# Altium schematic sheet STM.SchDoc
size 406 x 254 mm; SheetNumber: 1; SheetTotal: 2
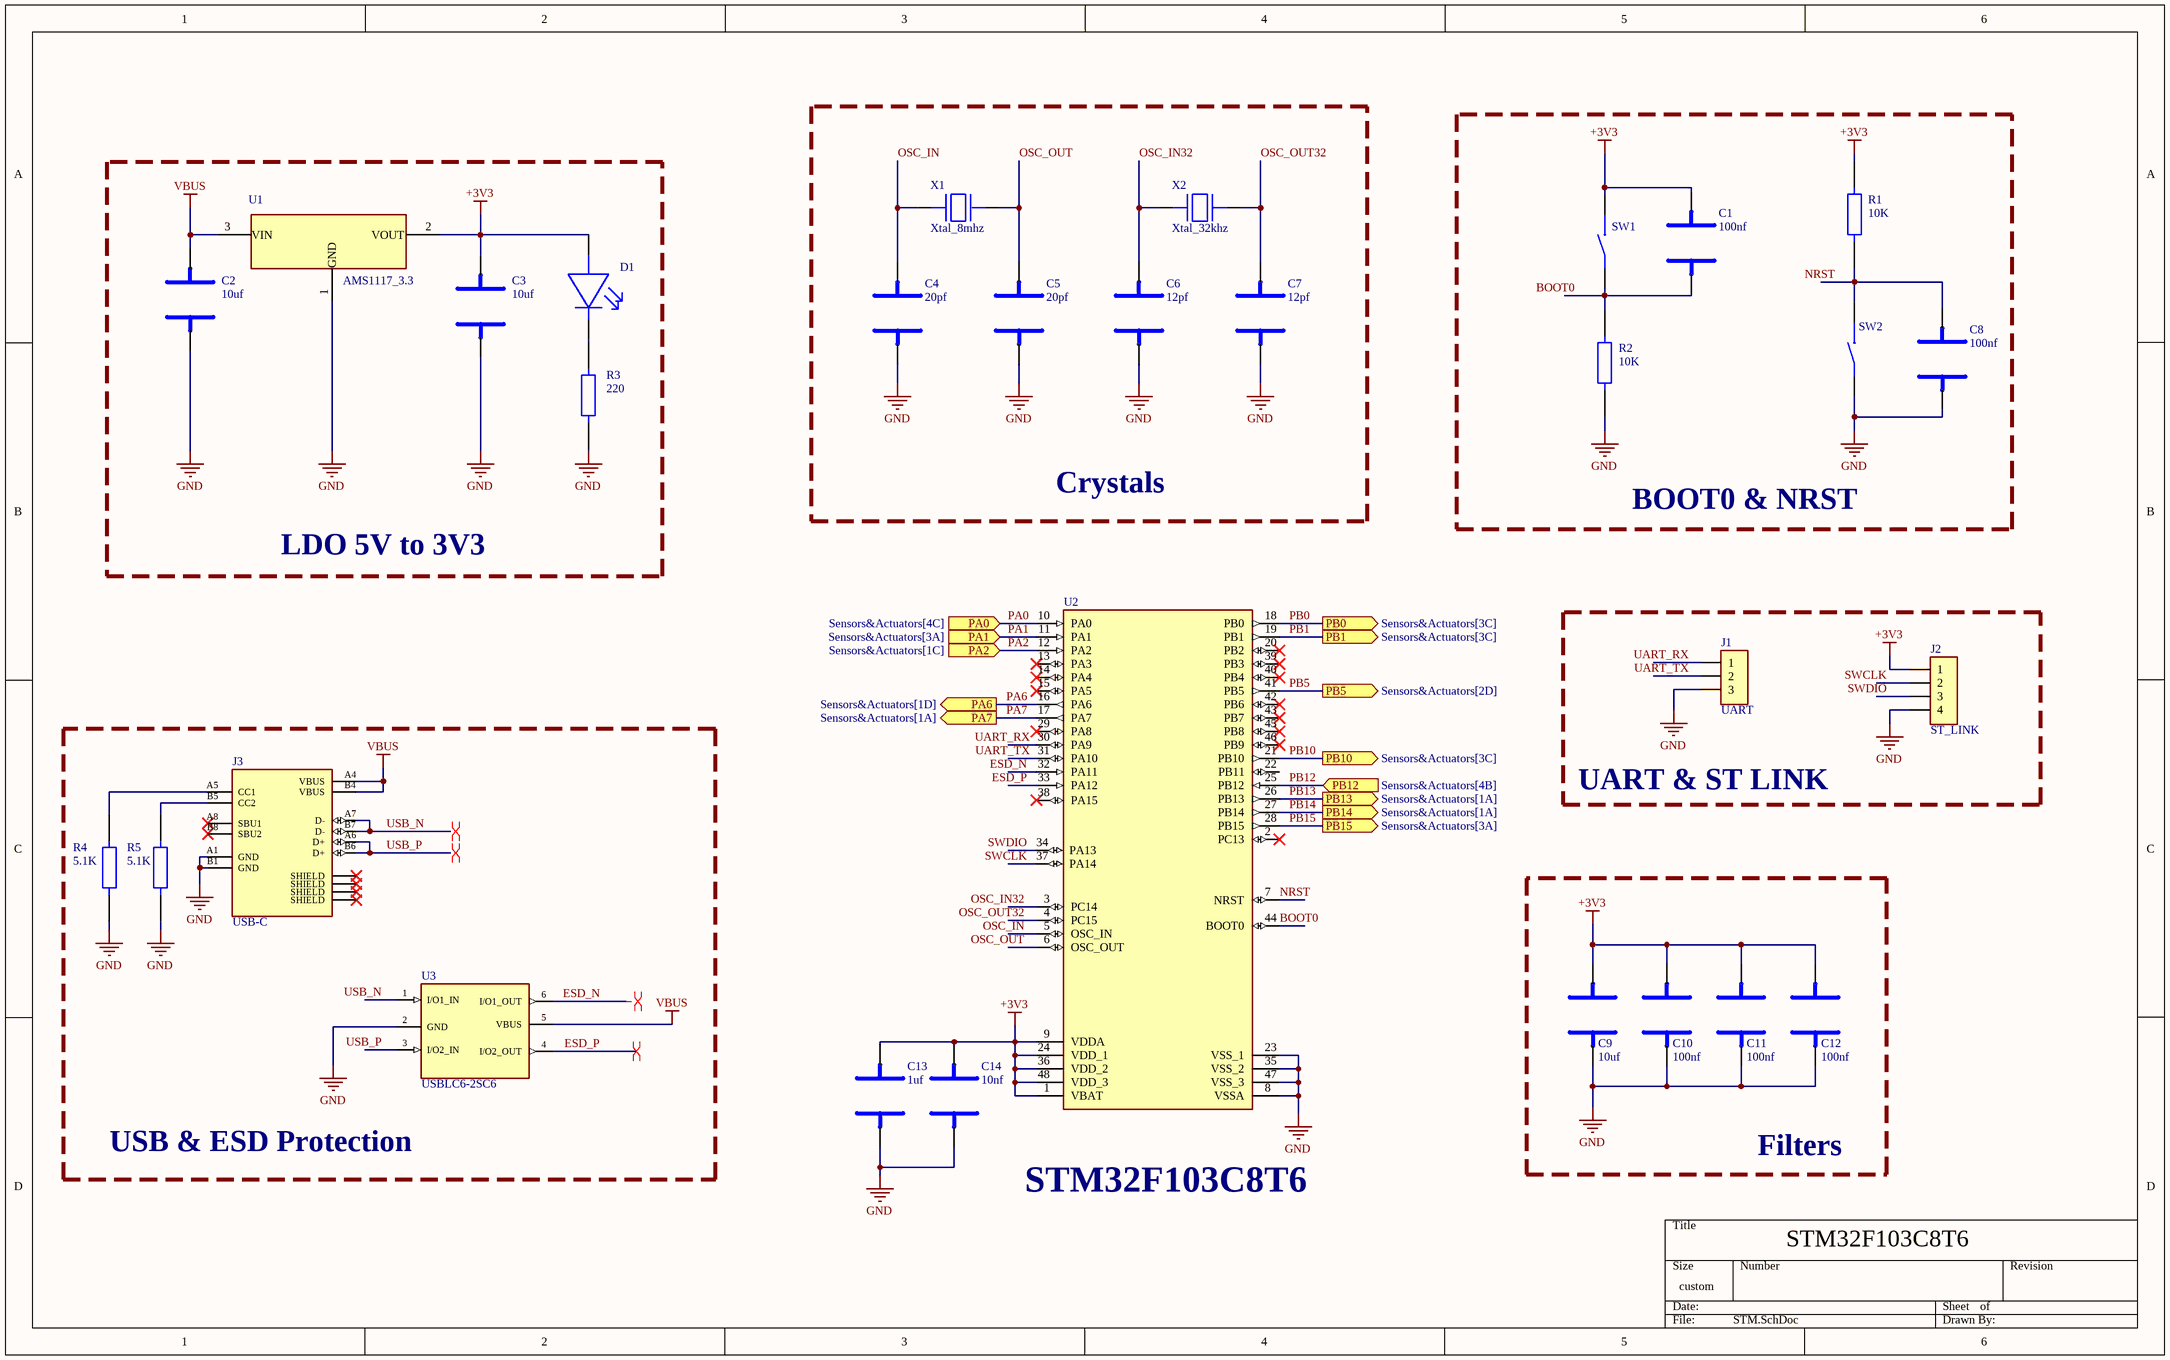
[diagram p0: STM.SchDoc]

## Parts
C1  100nf  [Cap_0805]
C2  10uf  [Cap_0805]
C3  10uf  [Cap_0805]
C4  20pf  [Cap_0805]
C5  20pf  [Cap_0805]
C6  12pf  [Cap_0805]
C7  12pf  [Cap_0805]
C8  100nf  [Cap_0805]
C9  10uf  [Cap_0805]
C10  100nf  [Cap_0805]
C11  100nf  [Cap_0805]
C12  100nf  [Cap_0805]
C13  1uf  [Cap_0805]
C14  10nf  [Cap_0805]
D1  LED_0805  [LED_0805]  (value not drawn)
J1  UART  [pin_header_3]
J2  ST_LINK  [pin_header_4]
J3  USB-C  [USB_C]
R1  10K  [RES_0805]
R2  10K  [RES_0805]
R3  220  [RES_0805]
R4  5.1K  [RES_0805]
R5  5.1K  [RES_0805]
SW1  Switch  [switch]  (value not drawn)
SW2  Switch  [switch]  (value not drawn)
U1  AMS1117_3.3  [AMS1117]
U2  STM32F103C8T6  [STM32F103C8T6]
U3  USBLC6-2SC6  [USBLC6-2SC6]
X1  Xtal_8mhz  [Xtal_8mhz]
X2  Xtal_32khz  [Xtal_32khz]

## Blocks framed on the sheet
Crystals: C4-C7 X1 X2
BOOT0 & NRST: C1 C8 R1 R2 SW1 SW2
LDO 5V to 3V3: C2 C3 D1 R3 U1
UART & ST LINK: J1 J2
USB & ESD Protection: J3 R4 R5 U3
Filters: C9-C12

## Ports
PA0 (in, see Sensors&Actuators[4C]), PA1 (in, see Sensors&Actuators[3A]), PA2 (in, see Sensors&Actuators[1C]), PA6 (out, see Sensors&Actuators[1D]), PA7 (out, see Sensors&Actuators[1A]), PB0 (out, see Sensors&Actuators[3C]), PB1 (out, see Sensors&Actuators[3C]), PB5 (out, see Sensors&Actuators[2D]), PB10 (out, see Sensors&Actuators[3C]), PB12 (in, see Sensors&Actuators[4B]), PB13 (out, see Sensors&Actuators[1A]), PB14 (out, see Sensors&Actuators[1A]), PB15 (out, see Sensors&Actuators[3A])

## Nets
+3V3: C1.2 C3.2 C9.2 C10.2 C11.2 C12.2 C13.2 C14.2 D1.1 J2.1 R1.1 SW1.2 U1.2(VOUT) U2.1(VBAT) U2.9(VDDA) U2.24(VDD_1) U2.36(VDD_2) U2.48(VDD_3)
GND: C2.1 C3.1 C4.1 C5.1 C6.1 C7.1 C8.1 C9.1 C10.1 C11.1 C12.1 C13.1 C14.1 J1.3 J2.4 J3.A1(GND) J3.B1(GND) R2.1 R3.2 R4.2 R5.2 SW2.1 U1.1(GND) U2.8(VSSA) U2.23(VSS_1) U2.35(VSS_2) U2.47(VSS_3) U3.2(GND)
VBUS: C2.2 J3.A4(VBUS) J3.B4(VBUS) U1.3(VIN) U3.5(VBUS)
BOOT0: C1.1 R2.2 SW1.1 U2.44(BOOT0)
ESD_N: U2.32(PA11) U3.6(I/O1_OUT)
ESD_P: U2.33(PA12) U3.4(I/O2_OUT)
NRST: C8.2 R1.2 SW2.2 U2.7(NRST)
OSC_IN: C4.2 U2.5(OSC_IN) X1.1
OSC_IN32: C6.2 U2.3(PC14) X2.1
OSC_OUT: C5.2 U2.6(OSC_OUT) X1.2
OSC_OUT32: C7.2 U2.4(PC15) X2.2
PA0: U2.10(PA0) ; port PA0
PA1: U2.11(PA1) ; port PA1
PA2: U2.12(PA2) ; port PA2
PA6: U2.16(PA6) ; port PA6
PA7: U2.17(PA7) ; port PA7
PB0: U2.18(PB0) ; port PB0
PB1: U2.19(PB1) ; port PB1
PB5: U2.41(PB5) ; port PB5
PB10: U2.21(PB10) ; port PB10
PB12: U2.25(PB12) ; port PB12
PB13: U2.26(PB13) ; port PB13
PB14: U2.27(PB14) ; port PB14
PB15: U2.28(PB15) ; port PB15
SWCLK: J2.2 U2.37(PA14)
SWDIO: J2.3 U2.34(PA13)
UART_RX: J1.1 U2.30(PA9)
UART_TX: J1.2 U2.31(PA10)
USB_N: J3.A7(D-) J3.B7(D-) U3.1(I/O1_IN)
USB_P: J3.A6(D+) J3.B6(D+) U3.3(I/O2_IN)
NetD1_2: D1.2 R3.1
NetJ3_A5: J3.A5(CC1) R4.1
NetJ3_B5: J3.B5(CC2) R5.1

Not connected (* = marked no-connect by the designer): J3 A8(SBU1)* B8(SBU2)* S1(SHIELD)* S2(SHIELD)* S3(SHIELD)* S4(SHIELD)*; U2 2(PC13)* 13(PA3)* 14(PA4)* 15(PA5)* 20(PB2)* 22(PB11) 29(PA8)* 38(PA15)* 39(PB3)* 40(PB4)* 42(PB6)* 43(PB7)* 45(PB8)* 46(PB9)*

## Layout directives
differential pair; differential pair class USB_Diff: USB_N, USB_P
differential pair; differential pair class ESD_DIFF: ESD_N, ESD_P

## Notes on the sheet
- STM32F103C8T6

## Library data of the parts
C1 C8 C10-C12 = Cap_0805_100nf: CAP CER 100nF 50V X7R 0805; MFR: Samsung Electro-Mechanics; MFR PART#: CL21B104KBCNNNC; Supplier: LCSC; Supplier PART#: C1711; ComponentLink1Description: Data Sheet; ComponentLink1URL: https://www.lcsc.com/datasheet/C15850.pdf?spm=wm.sxq.inf.ggs___wm.fly.bg.0.xh&lcsc_vid=RAIMXwZeRgRXUFAAT1RZBAEFEVIIVgdSQFlfUgUDFQcxVlNeQVVYX1FWR1FeVDsOAxUeFF5JWBYZEEoKFBINSQcJGk4eFQsCAgIaSgADAwAHC0slT1VdUFJIHxUDCw%3D%3D
C2 C3 C9 = Cap_0805_10uf: CAP CER 10uF 25V X5R 0805; MFR: Samsung Electro-Mechanics; MFR PART#: CL21A106KAYNNNE; Supplier: LCSC; Supplier PART#: C15850; ComponentLink1Description: Data Sheet; ComponentLink1URL: https://www.lcsc.com/datasheet/C15850.pdf?spm=wm.sxq.inf.ggs___wm.fly.bg.0.xh&lcsc_vid=RAIMXwZeRgRXUFAAT1RZBAEFEVIIVgdSQFlfUgUDFQcxVlNeQVVYX1FWR1FeVDsOAxUeFF5JWBYZEEoKFBINSQcJGk4eFQsCAgIaSgADAwAHC0slT1VdUFJIHxUDCw%3D%3D
C4 C5 = Cap_0805_20pf: CAP CER 20pF 50V C0G 0805; MFR: Samsung Electro-Mechanics; MFR PART#: CL21C200JBANNNC; Supplier: LCSC; Supplier PART#: C1798; ComponentLink1Description: Data Sheet; ComponentLink1URL: https://www.lcsc.com/datasheet/C1798.pdf?spm=wm.sxq.inf.ggs___wm.ssy.bg.11.xh&lcsc_vid=RAIMXwZeRgRXUFAAT1RZBAEFEVIIVgdSQFlfUgUDFQcxVlNeQFJfX1ZeR1FXVjsOAxUeFF5JWBYZEEoKFBINSQcJGk4dAgUUFAk%3D
C6 C7 = Cap_0805_12pf: CAP CER 12pF 50V C0G 0805; MFR: Samsung Electro-Mechanics; MFR PART#: CL21C120JBANNNC; Supplier: LCSC; Supplier PART#: C170110; ComponentLink1Description: Data Sheet; ComponentLink1URL: https://www.lcsc.com/datasheet/C170110.pdf?spm=wm.sxq.inf.ggs___wm.fly.bg.0.xh&lcsc_vid=RAIMXwZeRgRXUFAAT1RZBAEFEVIIVgdSQFlfUgUDFQcxVlNeQFJfX1BXQVdcVzsOAxUeFF5JWBYZEEoKFBINSQcJGk4dAgUUFAk%3D
C13 = Cap_0805_1uf: CAP CER 1uF 50V X7R 0805; MFR: Samsung Electro-Mechanics; MFR PART#: CL21B105KBFNNNE; Supplier: LCSC; Supplier PART#: C28323; ComponentLink1Description: Data Sheet; ComponentLink1URL: https://www.lcsc.com/datasheet/C15850.pdf?spm=wm.sxq.inf.ggs___wm.fly.bg.0.xh&lcsc_vid=RAIMXwZeRgRXUFAAT1RZBAEFEVIIVgdSQFlfUgUDFQcxVlNeQVVYX1FWR1FeVDsOAxUeFF5JWBYZEEoKFBINSQcJGk4eFQsCAgIaSgADAwAHC0slT1VdUFJIHxUDCw%3D%3D
C14 = Cap_0805_10nf: CAP CER 10nF 50V X7R 0805; MFR: Samsung Electro-Mechanics; MFR PART#: CL21B103KBANNNC; Supplier: LCSC; Supplier PART#: C1710; ComponentLink1Description: Data Sheet; ComponentLink1URL: https://www.lcsc.com/datasheet/C1710.pdf?spm=wm.sxq.inf.ggs___wm.ssy.bg.3.xh&lcsc_vid=RAIMXwZeRgRXUFAAT1RZBAEFEVIIVgdSQFlfUgUDFQcxVlNeQFJfX1VQRFlaXjsOAxUeFF5JWBYZEEoKFBINSQcJGk4dAgUUFAk%3D
D1 = LED_0805: LED RED 0805 SMD; MFR: YONGYUTAI; MFR PART#: YLED0805R; Supplier: LCSC; Supplier PART#: C19171391; ComponentLink1Description: Data Sheet; ComponentLink1URL: https://www.lcsc.com/datasheet/C19171391.pdf?spm=wm.sxq.inf.ggs___wm.fly.bg.0.xh&lcsc_vid=RAIMXwZeRgRXUFAAT1RZBAEFEVIIVgdSQFlfUgUDFQcxVlNeQVRaUlRVRlZcXjsOAxUeFF5JWBYZEEoKFBINSQcJGk4NBhADEA4cHktXRlhXSQwSGg0%3D
J1 = pin_header_3: 1kV 1 2.54mm Pin Header 3A 2.5mm Through Hole 6mm 3P -40℃~+105℃ 3mm Gold 1x3P Through Hole,P=2.54mm Headers, Male Pins; MFR: hanxia; MFR PART#: HX PH254-01-03-Z-L11.5 pcb pin header; Supplier: LCSC; Supplier PART#: C52016391; ComponentLink1Description: Data Sheet; ComponentLink1URL: https://www.lcsc.com/datasheet/C52016391.pdf?spm=wm.sxq.inf.ggs___wm.fly.bg.1.xh&lcsc_vid=RAIMXwZeRgRXUFAAT1RZBAEFEVIIVgdSQFlfUgUDFQcxVlNeQFJcUFdRQlZdUDsOAxUeFF5JWBYZEEoKFBINSQcJGk4NBhADEA4cHktXT1BADxALGw%3D%3D
J2 = pin_header_4: 1kV 1 2.54mm Pin Header 3A 2.5mm Through Hole 6mm -40℃~+105℃ 3mm Gold 4P 1x4P Through Hole,P=2.54mm Headers, Male Pins; MFR: hanxia; MFR PART#: HX PH254-01-04-Z-L11.5 straight pin header; Supplier: LCSC; Supplier PART#: C52016392; ComponentLink1Description: Data Sheet; ComponentLink1URL: https://www.lcsc.com/datasheet/C52016392.pdf?spm=wm.sxq.inf.ggs___wm.fly.bg.0.xh&lcsc_vid=RAIMXwZeRgRXUFAAT1RZBAEFEVIIVgdSQFlfUgUDFQcxVlNeQFJfXlVTRVBWXzsOAxUeFF5JWBYZEEoKFBINSQcJGk4NBhADEA4cHktRTlNADxALGw%3D%3D
J3 = USB-C: CONN RCPT Type-C 16POS SMD; MFR: Korean Hroparts Elec; MFR PART#: TYPE-C-31-M-12; Supplier: LCSC; Supplier PART#: C165948; ComponentLink1Description: Data Sheet; ComponentLink1URL: https://www.lcsc.com/datasheet/C165948.pdf?spm=wm.sxq.inf.ggs___wm.fly.bg.1.xh&lcsc_vid=RAIMXwZeRgRXUFAAT1RZBAEFEVIIVgdSQFlfUgUDFQcxVlNeQFJeVVJTRFBWUjsOAxUeFF5JWBYZEEoKFBINSQcJGk4%3D
R1 R2 = RES_0805_10K: RES 10kΩ ±0.1% 125mW 0805; MFR: YAGEO; MFR PART#: RT0805BRD0710KL; Supplier: LCSC; Supplier PART#: C110775; ComponentLink1Description: Data Sheet; ComponentLink1URL: https://www.lcsc.com/datasheet/C95781.pdf?spm=wm.sxq.inf.ggs___wm.fly.bg.2.xh&lcsc_vid=RAIMXwZeRgRXUFAAT1RZBAEFEVIIVgdSQFlfUgUDFQcxVlNeQVRaVlNURlFeXzsOAxUeFF5JWBYZEEoKFBINSQcJGk4eFQsCAgIaSgADAwAHC0sFHwgeShYDBAgdEwsUWhIbFQIHFARDCgsTGRUxEQtLR1leUklTWlAFOCdUT1lXUlZVWQkaCgg%3D
R3 = RES_0805_220: RES 220Ω ±0.1% 125mW 0805; MFR: YAGEO; MFR PART#: RT0805BRD07220RL; Supplier: LCSC; Supplier PART#: C865304; ComponentLink1Description: Data Sheet; ComponentLink1URL: https://www.lcsc.com/datasheet/C865304.pdf?spm=wm.sxq.inf.ggs___wm.fly.bg.8.xh&lcsc_vid=RAIMXwZeRgRXUFAAT1RZBAEFEVIIVgdSQFlfUgUDFQcxVlNeQFJfUlFQQ1NaVzsOAxUeFF5JWBYZEEoKFBINSQcJGk4NBhADEA4cHktfQ1hADxALGw%3D%3D
R4 R5 = RES_0805_5.1K: RES 5.1kΩ ±1% 125mW 0805; MFR: YAGEO; MFR PART#: RC0805FR-075K1L; Supplier: LCSC; Supplier PART#: C84375; ComponentLink1Description: Data Sheet; ComponentLink1URL: https://www.lcsc.com/datasheet/C84375.pdf?spm=wm.sxq.inf.ggs___wm.fly.bg.2.xh&lcsc_vid=RAIMXwZeRgRXUFAAT1RZBAEFEVIIVgdSQFlfUgUDFQcxVlNeQFJfX1xTQ1RYXjsOAxUeFF5JWBYZEEoKFBINSQcJGk4dAgUUFAk%3D
SW1 SW2 = Switch: SWITCH TACTILE SPST SMD; MFR: SHOU HAN; MFR PART#: TS342A2P-WZ; Supplier: LCSC; Supplier PART#: C557591; ComponentLink1Description: Data Sheet; ComponentLink1URL: https://www.lcsc.com/datasheet/C557591.pdf?spm=wm.sxq.inf.ggs___wm.fly.bg.15.xh&lcsc_vid=RAIMXwZeRgRXUFAAT1RZBAEFEVIIVgdSQFlfUgUDFQcxVlNeQFJfXlFWRFdeVTsOAxUeFF5JWBYZEEoKFBINSQcJGk4NBhADEA4cHktQQlFADxALGw%3D%3D
U1 = AMS1117_3.3: 1A Low Dropout (LDO) Regulator; MFR: Advanced Monolithic Systems; MFR PART#: AMS1117-3.3; Supplier: LCSC; Supplier PART#: C6186; ComponentLink1Description: Data Sheet; ComponentLink1URL: https://www.lcsc.com/datasheet/C6186.pdf?spm=wm.sxq.inf.ggs&lcsc_vid=RAIMXwZeRgRXUFAAT1RZBAEFEVIIVgdSQFlfUgUDFQcxVlNeQVRaVlRTQ1NcVTsOAxUeFF5JWBYZEEoBGA4JCwFIFA4DSA%3D%3D
U2 = STM32F103C8T6: Medium-density performance line Arm-based 32-bit MCU with 64 or 128 KB Flash, USB, CAN, 7 timers, 2 ADCs, 9 com. interfaces; MFR: ST; MFR PART#: STM32F103C8T6; Supplier: LCSC; Supplier PART#: C8734; ComponentLink1Description: Data Sheet; ComponentLink1URL: https://www.lcsc.com/datasheet/C8734.pdf?spm=wm.sxq.inf.ggs___wm.ssy.em.0.tz&lcsc_vid=RAIMXwZeRgRXUFAAT1RZBAEFEVIIVgdSQFlfUgUDFQcxVlNeQFJcU1RRRFJcVTsOAxUeFF5JWBYZEEoKFBINSQcJGk4NBhADEA4cHktTQlhADxALGw%3D%3D
U3 = USBLC6-2SC6: ESD DIODE 5.25VWM 17VC SOT-23-6L; MFR: ST; MFR PART#: USBLC6-2SC6; Supplier: LCSC; Supplier PART#: C7519; ComponentLink1Description: Data Sheet; ComponentLink1URL: https://www.lcsc.com/datasheet/C7519.pdf?spm=wm.sxq.inf.ggs___wm.fly.bg.0.xh&lcsc_vid=RAIMXwZeRgRXUFAAT1RZBAEFEVIIVgdSQFlfUgUDFQcxVlNeQFJfUVNWT1lXUDsOAxUeFF5JWBYZEEoKFBINSQcJGk4NBhADEA4cHktXRlhXSQwSGg0%3D
X1 = Xtal_8mhz: CRYSTAL 8MHz 20pF SMD; MFR: YXC Crystal Oscillators; MFR PART#: X49SM8MSD2SC; Supplier: LCSC; Supplier PART#: C12674; ComponentLink1Description: Data Sheet; ComponentLink1URL: https://www.lcsc.com/datasheet/C12674.pdf?spm=wm.sxq.inf.ggs___wm.fly.bg.17.xh&lcsc_vid=RAIMXwZeRgRXUFAAT1RZBAEFEVIIVgdSQFlfUgUDFQcxVlNeQFJdUVVTQFJfUTsOAxUeFF5JWBYZEEoKFBINSQcJGk4eFQsCAgIaSgADAwAHC0slQlNYUlNRRE8GEwkK
X2 = Xtal_32khz: CRYSTAL 32.768kHz 12.5pF SMD; MFR: NDK; MFR PART#: NX3215SA-32.768K-STD-MUA-8; Supplier: LCSC; Supplier PART#: C156245; ComponentLink1Description: Data Sheet; ComponentLink1URL: https://www.lcsc.com/datasheet/C156245.pdf?spm=wm.sxq.inf.ggs&lcsc_vid=RAIMXwZeRgRXUFAAT1RZBAEFEVIIVgdSQFlfUgUDFQcxVlNeQFJcUFNXQ1NfXjsOAxUeFF5JWBYZEEoKFBINSQcJGk4dAgUUFAk%3D